# EAGLE schematic har_DAA_FPGA_Programming (EAGLE 7.6.0)
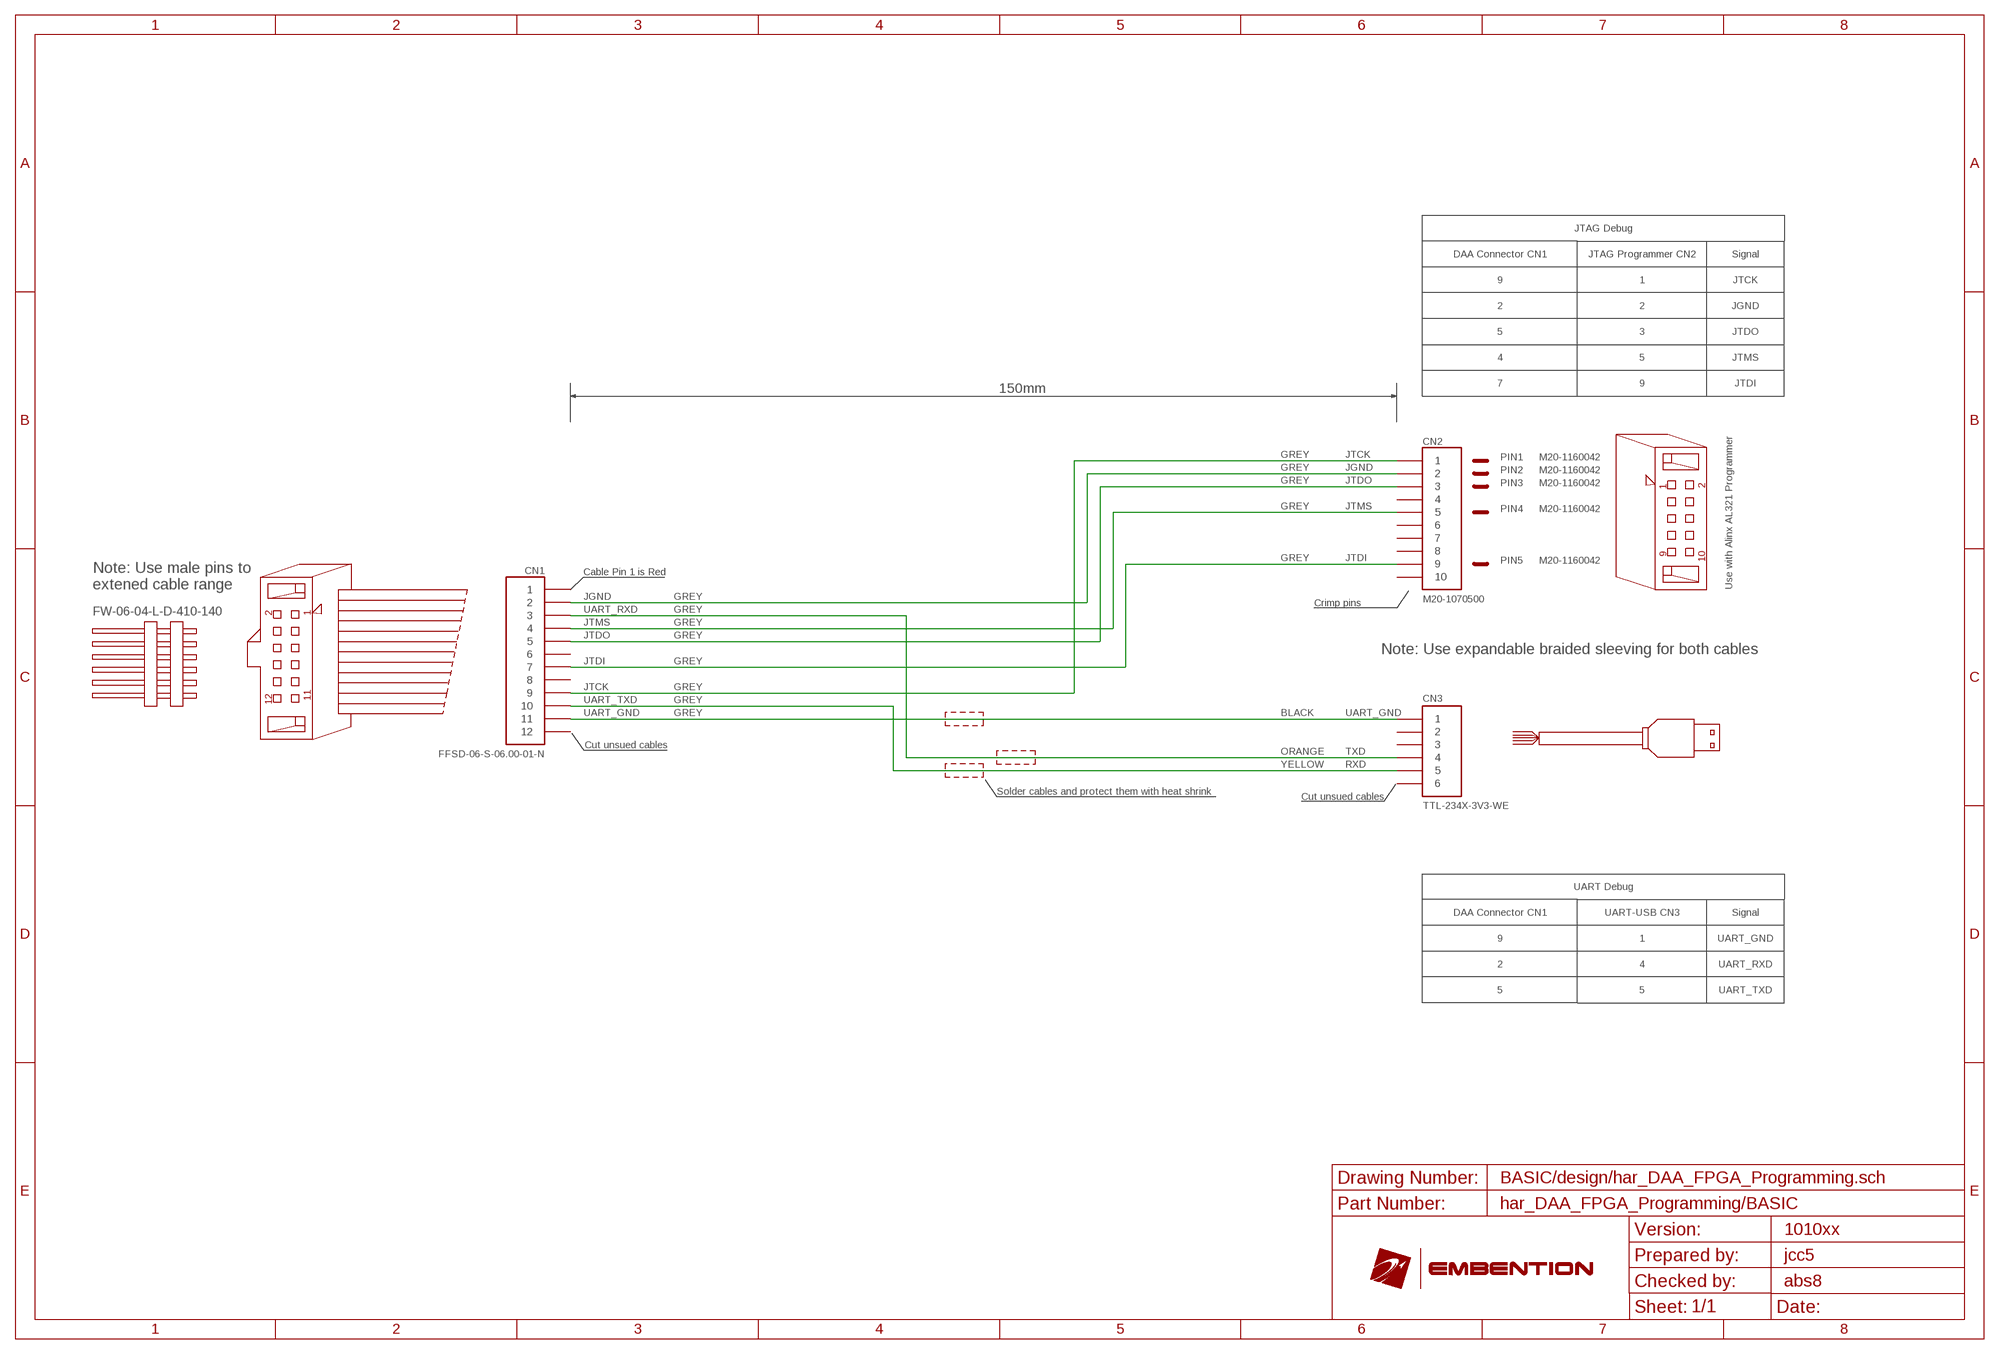
[diagram p0: schematic, sheet 1]

## Parts
CN1  FFSD-06-S-06.00-01-N  12-PIN-NUM  [25-PIN]
CN2  M20-1070500  10-PIN-NUM  [25-PIN]
CN3  TTL-234X-3V3-WE  6-PIN-NUM  [25-PIN]
CN4  FW-06-04-L-D-410-140  0-PIN  [CLAMP]
PIN1  M20-1160042  CONN-PIN  [1-PIN]
PIN2  M20-1160042  CONN-PIN  [1-PIN]
PIN3  M20-1160042  CONN-PIN  [1-PIN]
PIN4  M20-1160042  CONN-PIN  [1-PIN]
PIN5  M20-1160042  CONN-PIN  [1-PIN]

## Nets
JGND: CN1.P$2 CN2.P$2
JTCK: CN1.P$9 CN2.P$1
JTDI: CN1.P$7 CN2.P$9
JTDO: CN1.P$5 CN2.P$3
JTMS: CN1.P$4 CN2.P$5
UART_GND: CN1.P$11 CN3.P$1
UART_RXD: CN1.P$3 CN3.P$4
UART_TXD: CN1.P$10 CN3.P$5
Unconnected: CN1.P$1 CN1.P$6 CN1.P$8 CN1.P$12 CN2.P$4 CN2.P$6 CN2.P$7 CN2.P$8 CN2.P$10 CN3.P$2 CN3.P$3 CN3.P$6 PIN1.P$1 PIN2.P$1 PIN3.P$1 PIN4.P$1 PIN5.P$1

## Notes on the sheet
- JTAG Debug
- DAA Connector CN1 | JTAG Programmer CN2 | Signal
- 9 | 1 | JTCK
- 2 | 2 | JGND
- 5 | 3 | JTDO
- 4 | 5 | JTMS
- 7 | 9 | JTDI
- 150mm
- GREY
- GREY
- GREY | 1 | 2
- GREY
- 9 | 10
- GREY
- Cable Pin 1 is Red
- Note: Use male pins to 
  extened cable range
- Use with Alinx AL321 Programmer
- GREY
- Crimp pins
- 2 | 1 | GREY
- GREY
- GREY
- Note: Use expandable braided sleeving for both cables
- GREY
- GREY
- 11 | GREY
- 12
- GREY | BLACK
- Cut unsued cables
- ORANGE | TXD
- YELLOW | RXD
- Solder cables and protect them with heat shrink
- Cut unsued cables
- UART Debug
- DAA Connector CN1 | UART-USB CN3 | Signal
- 9 | 1 | UART_GND
- 2 | 4 | UART_RXD
- 5 | 5 | UART_TXD
- BASIC/design/har_DAA_FPGA_Programming.sch
- har_DAA_FPGA_Programming/BASIC
- 1010xx
- jcc5
- abs8

## Library data of the parts
CN1 = emb-har-Connectors:12-PIN-NUM; PNS: HAR-WIRE-FFSD-06-S-06.00-01-N.pns
CN2 = emb-har-Connectors:10-PIN-NUM; PNS: CONN-M20-1070500.pns
CN3 = emb-har-Connectors:6-PIN-NUM; PNS: HAR-WIRE-TTL-234X-3V3-WE.pns
CN4 = emb-har-Connectors:0-PIN; PNS: CONN-FW-06-04-L-D-410-140.pns
PIN1-PIN5 = emb-har-Electrical_Terminations:CONN-PIN; PNS: HAR-TERM-M20-1160042.pns

## Net classes
1 600V: width 1 mm, clearance 2 mm